# Altium schematic sheet ZIF_Bridge_4.SchDoc
size A4; Organization: Altium Limited; Address1: L3, 12a Rodborough Rd; Address2: Frenchs Forest; Address3: NSW; Address4: Australia 2086
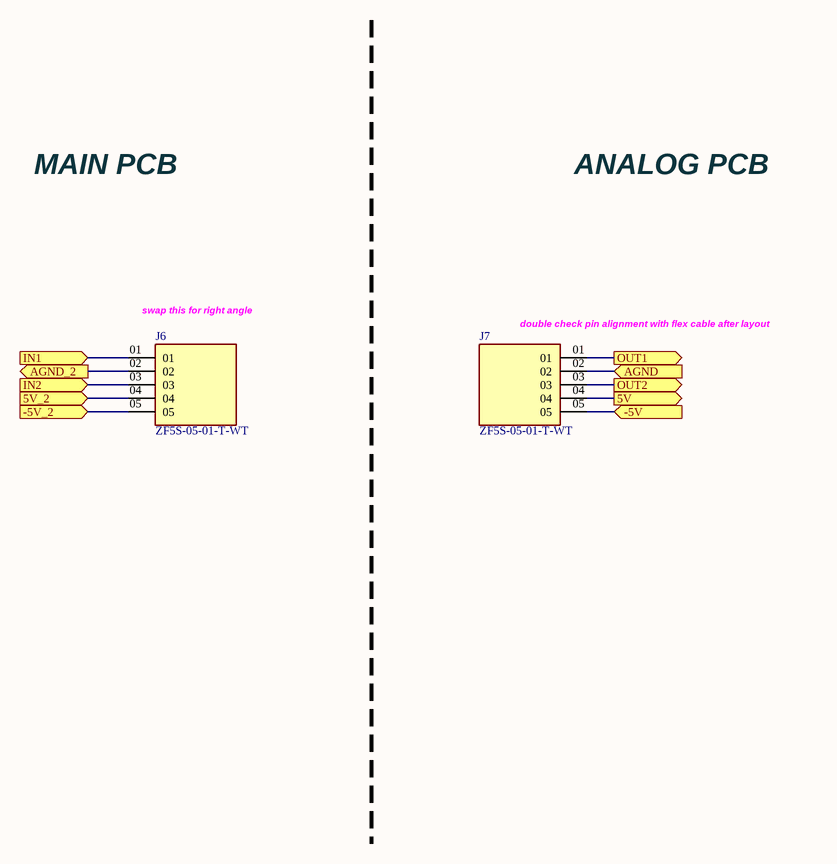
[diagram p0: ZIF_Bridge_4.SchDoc]

## Parts
J6  ZF5S-05-01-T-WT  [SAMTEC_ZF5S-05-01-T-WT]
J7  ZF5S-05-01-T-WT  [SAMTEC_ZF5S-05-01-T-WT]

## Ports
5V (out), 5V_2 (in), -5V (in), -5V_2 (in), AGND (in), AGND_2 (out), IN1 (in), IN2 (in), OUT1 (out), OUT2 (out)

## Nets
5V: J7.04 ; port 5V
5V_2: J6.04 ; port 5V_2
-5V: J7.05 ; port -5V
-5V_2: J6.05 ; port -5V_2
AGND: J7.02 ; port AGND
AGND_2: J6.02 ; port AGND_2
IN1: J6.01 ; port IN1
IN2: J6.03 ; port IN2
OUT1: J7.01 ; port OUT1
OUT2: J7.03 ; port OUT2

## Notes on the sheet
- MAIN PCB
- ANALOG PCB
- (near J6) swap this for right angle
- (near J7) double check pin alignment with flex cable after layout
- Title
- Date:
- RE:
- Arturo di Girolamo
- Size:
- A3
- A

## Library data of the parts
J6 J7 = ZF5S-05-01-T-WT: Value: *; Package: None; MP: ZF5S-05-01-T-WT; Price: None; Availability: Unavailable